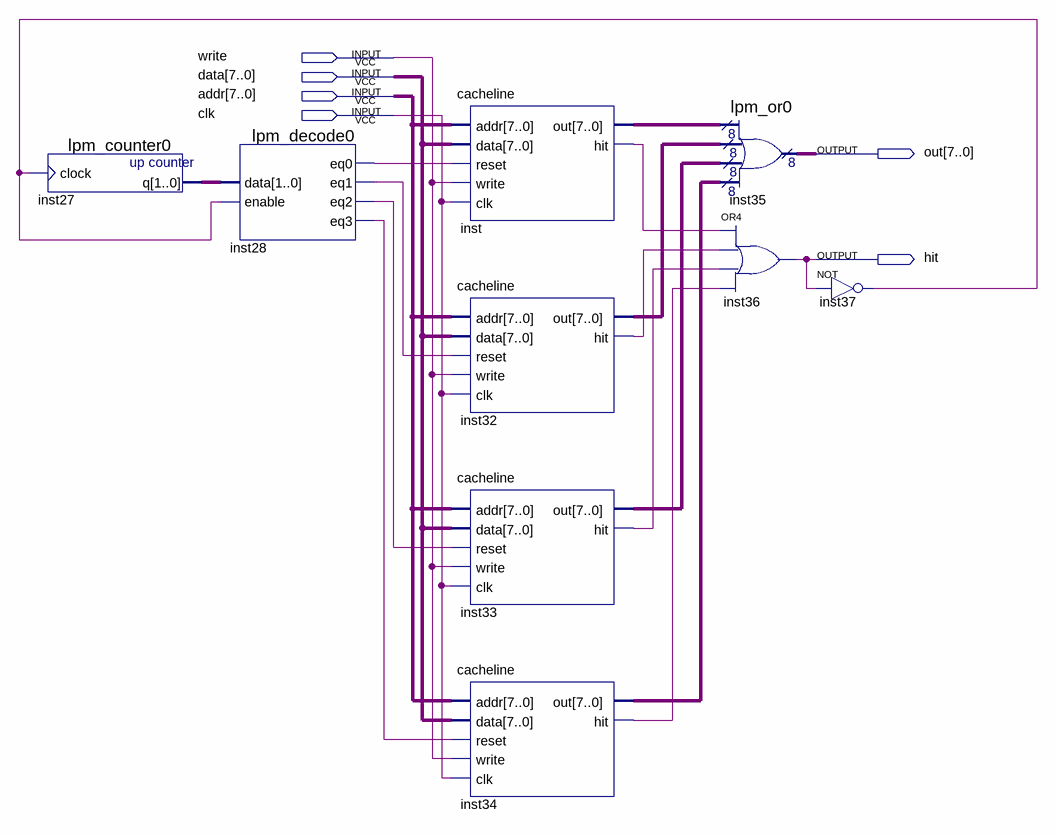
[diagram p0: schematic sheet]
// Quartus schematic cache.bdf as structural Verilog: 9 symbols, 6 pins
module cache (
  input  write,
  input  [7:0] data,
  input  [7:0] addr,
  input  clk,
  output [7:0] out,
  output hit
);

  wire inst28_eq0, inst28_eq1, inst28_eq2, inst28_eq3, inst32_hit, inst33_hit, inst34_hit, inst37_out,
       inst_hit;
  wire [1:0] inst27_q;
  wire [7:0] inst32_out, inst33_out, inst34_out, inst_out;

  lpm_counter0 inst27 (.clock(inst37_out), .q(inst27_q));
  lpm_decode0 inst28 (
    .data(inst27_q), .enable(inst37_out), .eq0(inst28_eq0), .eq1(inst28_eq1), .eq2(inst28_eq2),
    .eq3(inst28_eq3));
  cacheline inst (
    .addr(addr), .data(data), .reset(inst28_eq0), .write(write), .clk(clk), .out(inst_out), .hit(inst_hit));
  cacheline inst32 (
    .addr(addr), .data(data), .reset(inst28_eq1), .write(write), .clk(clk), .out(inst32_out), .hit(inst32_hit));
  cacheline inst33 (
    .addr(addr), .data(data), .reset(inst28_eq2), .write(write), .clk(clk), .out(inst33_out), .hit(inst33_hit));
  cacheline inst34 (
    .addr(addr), .data(data), .reset(inst28_eq3), .write(write), .clk(clk), .out(inst34_out), .hit(inst34_hit));
  lpm_or0 inst35 (.data0x(inst_out), .data1x(inst32_out), .data2x(inst33_out), .data3x(inst34_out), .result(out));
  or inst36 (hit, inst_hit, inst32_hit, inst33_hit, inst34_hit);
  not inst37 (inst37_out, hit);
endmodule
